# EAGLE design usbshield-r1 (EAGLE 5.12)
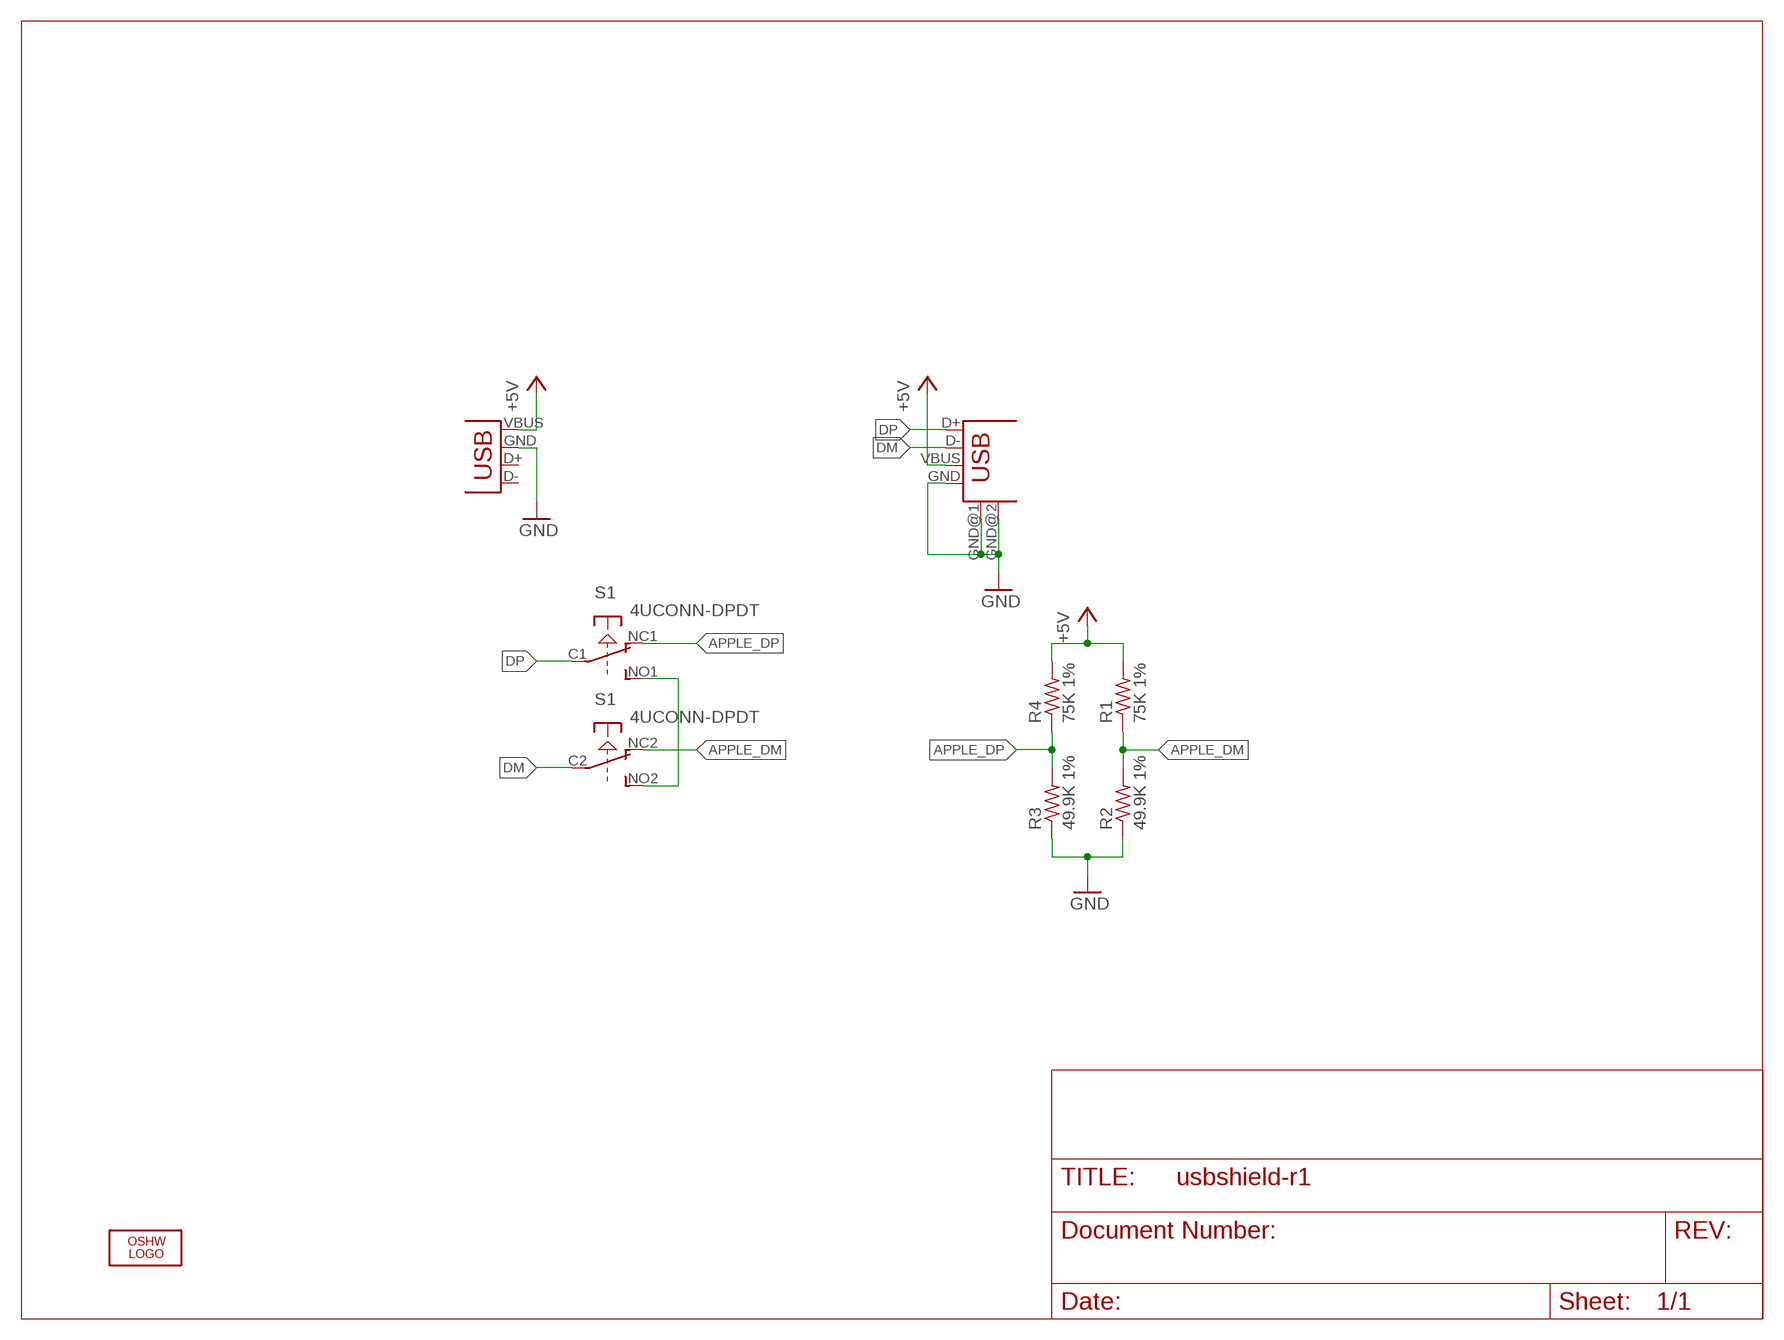
[diagram p0: schematic, sheet 1]

## Parts
LOGO1  OSHW_LOGO_FILLX0100-NT  [OSHW_FILLX100_NOTEXT]
R1  75K 1%  R-US_R0603  [R0603]
R2  49.9K 1%  R-US_R0603  [R0603]
R3  49.9K 1%  R-US_R0603  [R0603]
R4  75K 1%  R-US_R0603  [R0603]
S1  4UCONN-DPDT  [4UCONN-DPDT]
USB1  USB-A-H  [USB-A-H]
USB2  USB-A-H  [USB-A-H]

## Nets
+5V: R1.2 R4.2 USB1.VBUS USB2.VBUS(GND)
APPLE_DM: R1.1 R2.2 S1.NC2(O)
APPLE_DP: R3.2 R4.1 S1.NC1(O)
DM: S1.C2(P) USB1.D-
DP: S1.C1(P) USB1.D+
GND: R2.1 R3.1 USB1.GND USB1.GND@1(GND) USB1.GND@2(GND) USB2.GND(VBUS)
N$1: S1.NO1(S) S1.NO2(S)
Unconnected: USB2.D+(D-) USB2.D-(D+)

## Library data of the parts
LOGO1 = ohw-logo:OSHW_LOGO_FILL
R1-R4 = rcl:R-US_: RESISTOR, American symbol
S1 = rbg-generic-tact-switch:4UCONN-DPDT
USB1 = con-usb-2:USB: USB Connectors USB-B-PTH is fully proven SKU : PRT-00139 USB-miniB is fully proven SKU : PRT-00587 USB-A-PCB is untested. USB-A-H is throughly reviewed, but untested. Spark Fun Electronics SKU : PRT-00437 USB-B-SMT is throughly reviewed, but untested. Needs silkscreen touching up. USB-A-S has not been used/tested USB-MB-H has not been used/tested
USB2 = sfe-sparkfun:USB: USB Connectors USB-B-PTH is fully proven SKU : PRT-00139 USB-miniB is fully proven SKU : PRT-00587 USB-A-PCB is untested. USB-A-H is throughly reviewed, but untested. Spark Fun Electronics SKU : PRT-00437 USB-B-SMT is throughly reviewed, but untested. Needs silkscreen touching up. USB-A-S has not been used/tested USB-MB-H has not been used/tested

## Board
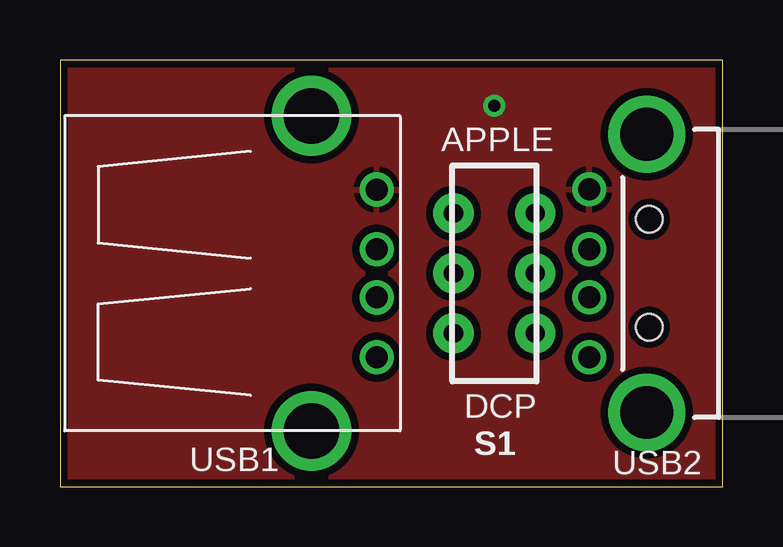
[diagram p1: board, top side]
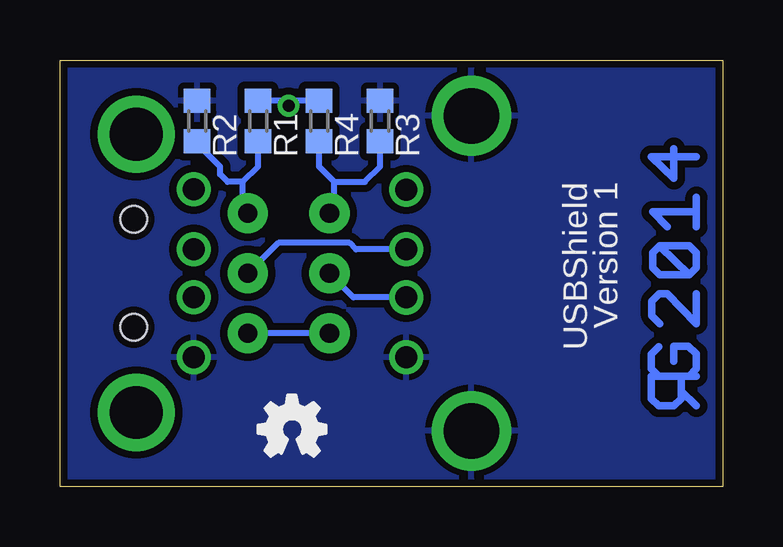
[diagram p2: board, bottom side, seen from below]

Size 27.62 x 17.78 mm. Coordinates in mm from the lower left corner, seen from the top.
Outline: 0,0 27.62,0 27.62,17.78 0,17.78 0,0
Copper layers (1*16): Top 0.035mm / dielectric 1.5mm / Bottom 0.035mm
Design rules "default *": minimum track width 10mil, minimum drill 0.5mm, track to track 8mil, track to pad 8mil, pad to pad 8mil, via to via 8mil, smd to smd 8mil, copper to edge 10mil, drill to drill 8mil, minimum pad ring 10mil, minimum via ring 8mil, stop-mask expansion 4mil, vias tented up to drill 20mil, thermal gap 10mil

### Footprints (pad centres in the part's own frame; a part is rotated, then mirrored left to right if it is on the bottom)
R0603 = smd 1 x 1.1: 1 -0.85,0; 2 0.85,0
4UCONN-DPDT = drill 0.8 pad 1.676 round: C1 -1.7,0; C2 1.7,0; NC1 -1.7,2.5; NC2 1.7,2.5; NO1 -1.7,-2.5; NO2 1.7,-2.5
USB-A-H = drill 0.914 round: D+ 2.718,-1.003; D- 2.718,1.003; GND 2.718,-3.493; VBUS 2.718,3.493 | drill 2.311 round: GND@1 0,6.566; GND@2 0,-6.566
USB-A-H' = drill 0.914 round: D+ 2.4,1; D- 2.4,-1; GND 2.4,3.5; VBUS 2.4,-3.5 | drill 2.2 round: GND@1 0,5.8; GND@2 0,-5.8 | hole 1.1: -0.1,2.25; -0.1,-2.25

### Placement (x,y rotation side)
LOGO1  19.37,1.27 0 bottom
R1  19.37,15.24 90 bottom
R2  21.91,15.24 270 bottom
R3  14.29,15.24 270 bottom
R4  16.83,15.24 90 bottom
S1  18.1,8.89 0 top
U$1  [RGLOGO_SMALL_2014]  0.95,4.76 90 bottom
USB1  10.48,8.89 0 top
USB2  USB-A-H  [USB-A-H']  24.45,8.89 180 top

### Tracks (layer width: path | path; a pad name or v marks a point on that pad's centre or on a via)
+5V  (via drill 0.5)
  Bottom 0.254: R4.2 17.88,16.09 v18.1,15.88 18.31,16.09 R1.2
  pour Top (isolate 0.305): -2.22,19.05 28.26,19.05 28.26,-1.27 -2.22,-1.27
APPLE_DM
  Bottom 0.254: R1.1 19.37,13.34 20,12.7 | 20,12.7 20,11.6 S1.NC2 | R2.2 21.91,14.29 20.95,13.34 20.95,13.02 20.64,12.7 20,12.7
APPLE_DP
  Bottom 0.254: R3.2 14.29,13.34 14.92,12.7 16.19,12.7 | R4.1 16.83,13.34 16.19,12.7 | 16.19,12.7 16.19,11.6 S1.NC1
DM
  Bottom 0.254: USB1.D- 15.29,9.89 15.56,10.16 18.53,10.16 S1.C2
DP
  Bottom 0.254: USB1.D+ 15.39,7.89 S1.C1
GND
  pour Bottom (isolate 0.305): -2.22,19.05 28.26,19.05 28.26,-1.27 -2.22,-1.27
N$1
  Bottom 0.254: S1.NO1 S1.NO2

### Text on the board
tNames: APPLE | DCP
bNames: Version 1 | USBShield